# EAGLE design TDS Sensor - no bottom silk (EAGLE 9.6.1)
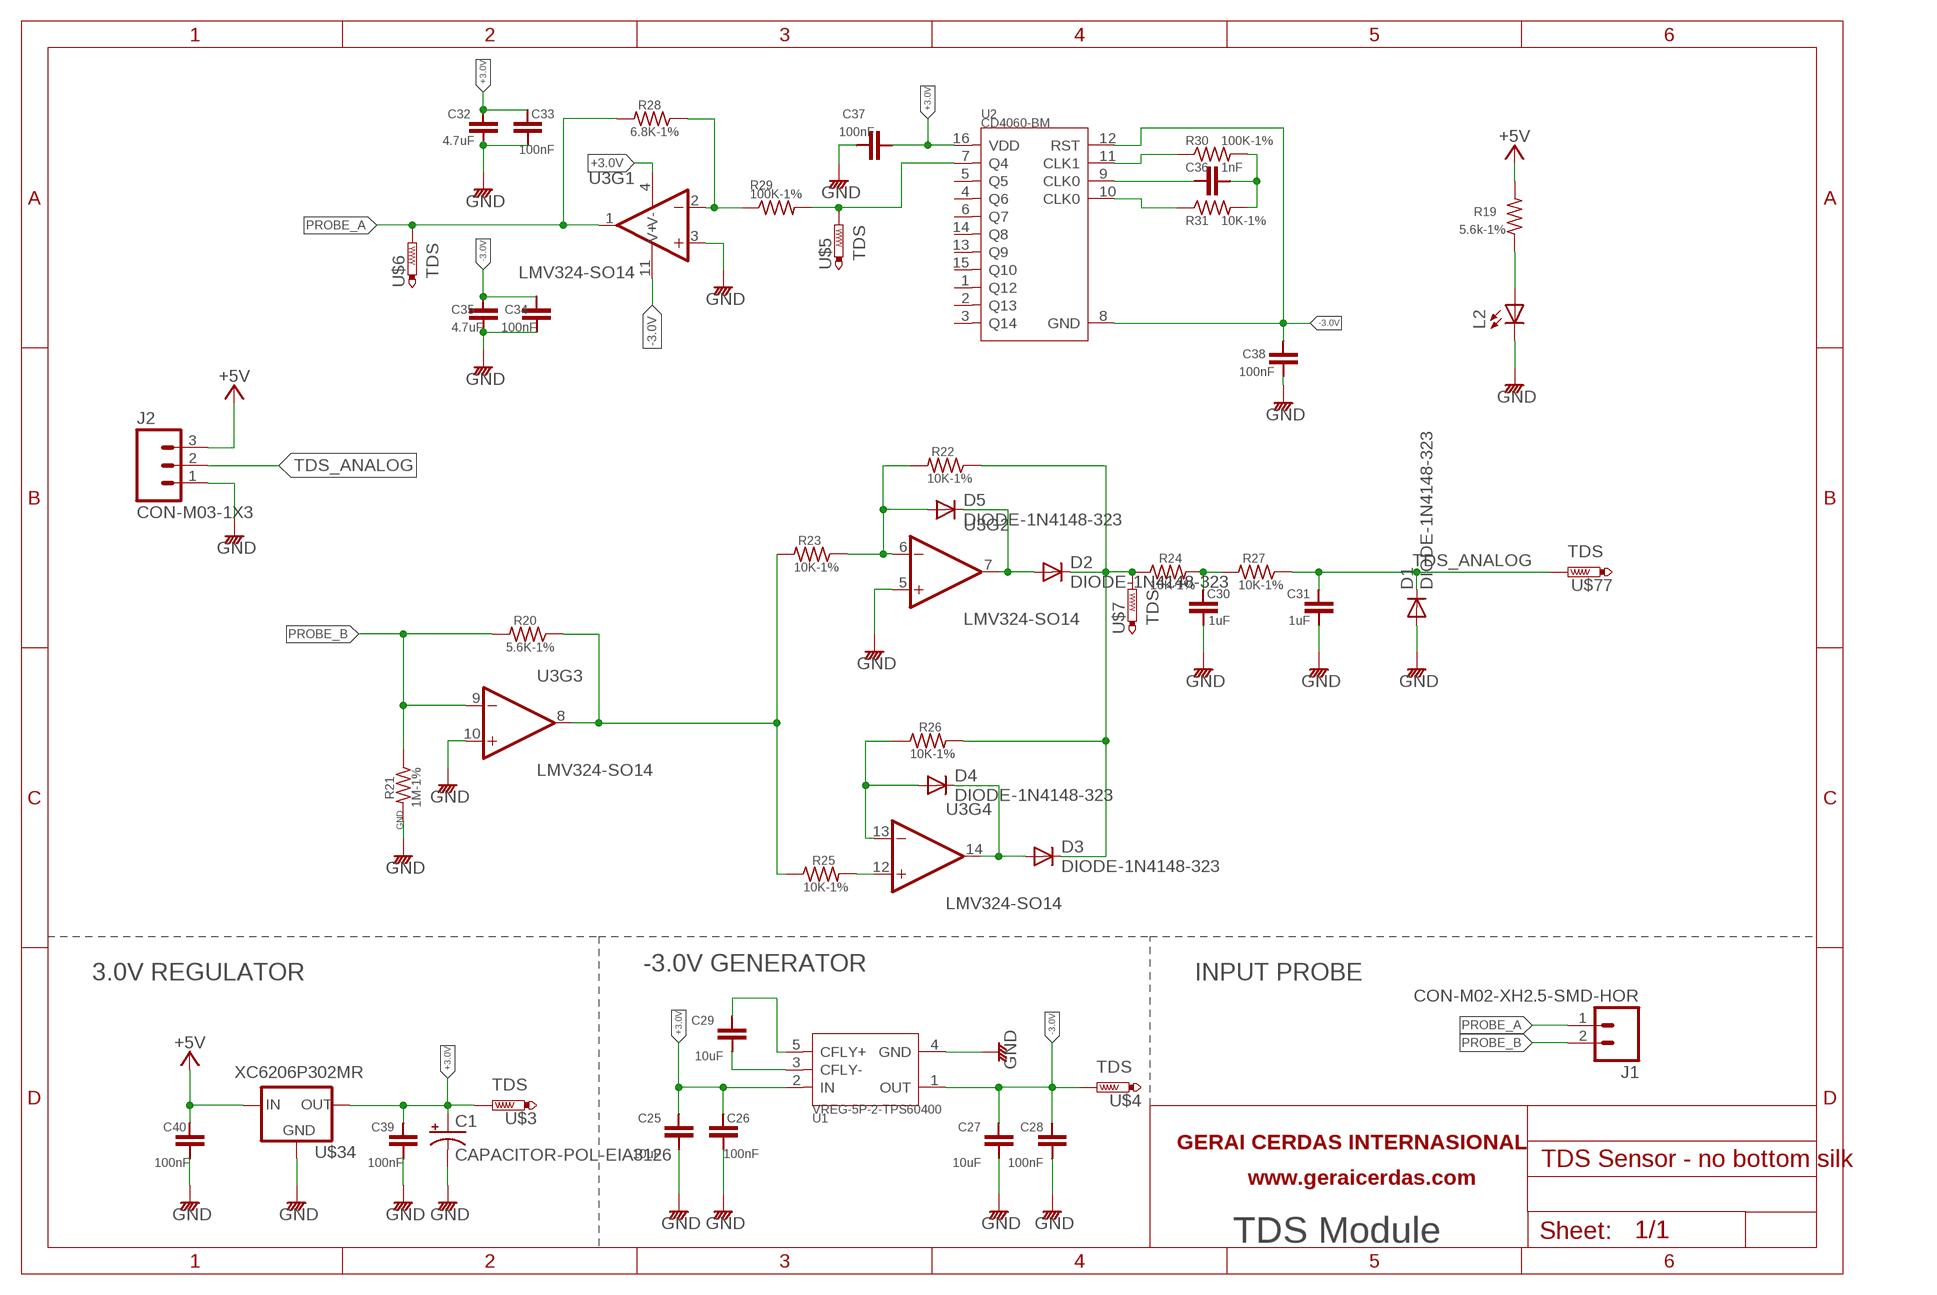
[diagram p0: schematic, sheet 1]

## Parts
C1  CAPACITOR-POL-EIA3126  [EIA3126]
C25  10uF  CAPACITOR-SMD0603  [C0603]
C26  100nF  CAPACITOR-SMD0603  [C0603]
C27  10uF  CAPACITOR-SMD0603  [C0603]
C28  100nF  CAPACITOR-SMD0603  [C0603]
C29  10uF  CAPACITOR-SMD0603  [C0603]
C30  1uF  CAPACITOR-SMD0603  [C0603]
C31  1uF  CAPACITOR-SMD0603  [C0603]
C32  4.7uF  CAPACITOR-SMD0603  [C0603]
C33  100nF  CAPACITOR-SMD0603  [C0603]
C34  100nF  CAPACITOR-SMD0603  [C0603]
C35  4.7uF  CAPACITOR-SMD0603  [C0603]
C36  1nF  CAPACITOR-SMD0603  [C0603]
C37  100nF  CAPACITOR-SMD0603  [C0603]
C38  100nF  CAPACITOR-SMD0603  [C0603]
C39  100nF  CAPACITOR-SMD0603  [C0603]
C40  100nF  CAPACITOR-SMD0603  [C0603]
D1  DIODE-1N4148-323  [SOD-323]
D2  DIODE-1N4148-323  [SOD-323]
D3  DIODE-1N4148-323  [SOD-323]
D4  DIODE-1N4148-323  [SOD-323]
D5  DIODE-1N4148-323  [SOD-323]
J1  CON-M02-XH2.5-SMD-HOR  [JST-XH2.5-2P-SMD-HORZ]
J2  CON-M03-1X3  [CON-M03X1]
L2  LED-SMD0805  [LED0805]
R19  5.6k-1%  RESISTOR-SMD0603  [R0603]
R20  5.6K-1%  RESISTOR-SMD0603  [R0603]
R21  1M-1%  RESISTOR-SMD0603  [R0603]
R22  10K-1%  RESISTOR-SMD0603  [R0603]
R23  10K-1%  RESISTOR-SMD0603  [R0603]
R24  10K-1%  RESISTOR-SMD0603  [R0603]
R25  10K-1%  RESISTOR-SMD0603  [R0603]
R26  10K-1%  RESISTOR-SMD0603  [R0603]
R27  10K-1%  RESISTOR-SMD0603  [R0603]
R28  6.8K-1%  RESISTOR-SMD0603  [R0603]
R29  100K-1%  RESISTOR-SMD0603  [R0603]
R30  100K-1%  RESISTOR-SMD0603  [R0603]
R31  10K-1%  RESISTOR-SMD0603  [R0603]
U1  VREG-5P-2-TPS60400  [SOT-23-5]
U2  CD4060-BM  [SO-16]
U3  LMV324-SO14  [SO-14]
U$3  TDS  TESTPAD-SMD2.54  [TESTPAD_2.54]
U$4  TDS  TESTPAD-SMD2.54  [TESTPAD_2.54]
U$5  TDS  TESTPAD-SMD2.54  [TESTPAD_2.54]
U$6  TDS  TESTPAD-SMD2.54  [TESTPAD_2.54]
U$7  TDS  TESTPAD-SMD2.54  [TESTPAD_2.54]
U$28  FRAME  [A4-HOR]
U$34  XC6206P302MR  V-REG2-SOT23  [SOT-23]
U$77  TDS  TESTPAD-SMD2.54  [TESTPAD_2.54]

## Nets
+3.0V: C1.A(+) C25.2 C26.2 C32.2 C33.2 C37.1 C39.2 U1.2(IN) U2.16(VDD) U3.4(V+) U$3.TP U$34.2(OUT)
+5V: C40.2 J2.3 R19.2 U$34.3(IN)
-3.0V: C27.2 C28.2 C34.2 C35.2 C38.2 U1.1(OUT) U2.8(GND) U2.12(RST) U3.11(V-) U$4.TP
GND: C1.C(-) C25.1 C26.1 C27.1 C28.1 C30.1 C31.1 C32.1 C33.1 C34.1 C35.1 C37.2 C38.1 C39.1 C40.1 D1.A J2.1 L2.C R21.2 U1.4(GND) U3.3(+IN) U3.5(+IN) U3.10(+IN) U$34.1(ADJ)
N$1: R25.2 U3.12(+IN)
N$35: L2.A R19.1
N$37: D5.A R22.2 R23.1 U3.6(-IN)
N$38: D2.A D5.C U3.7(OUT)
N$39: D2.C D3.C R22.1 R24.1 R26.2 U$7.TP
N$41: D4.A R26.1 U3.13(-IN)
N$42: D3.A D4.C U3.14(OUT)
N$43: R20.1 R23.2 R25.1 U3.8(OUT)
N$44: C30.2 R24.2 R27.2
N$46: R28.1 R29.1 U3.2(-IN)
N$48: C29.2 U1.5(CFLY+)
N$49: R30.1 U2.11(CLK1)
N$50: C36.1 U2.9(CLK0)
N$51: R31.1 U2.10(CLK0)
N$52: C36.2 R30.2 R31.2
N$53: R29.2 U2.7(Q4) U$5.TP
N$54: C29.1 U1.3(CFLY-)
PROBE_A: J1.1 R28.2 U3.1(OUT) U$6.TP
PROBE_B: J1.2 R20.2 R21.1 U3.9(-IN)
TDS_ANALOG: C31.2 D1.C J2.2 R27.1 U$77.TP
Unconnected: U2.1(Q12) U2.2(Q13) U2.3(Q14) U2.4(Q6) U2.5(Q5) U2.6(Q7) U2.13(Q9) U2.14(Q8) U2.15(Q10)

## Notes on the sheet
- -3.0V GENERATOR
- 3.0V REGULATOR | INPUT PROBE
- TDS Module

## Library data of the parts
C1 = geraicerdas:CAPACITOR-POL
C25-C40 = geraicerdas:CAPACITOR
D1-D5 = geraicerdas:DIODE: DIODE, SWITCHING, 75V, SOD-523F-2 Source : View Datasheet <https://datasheet.lcsc.com/szlcsc/1810242227_ON-Semiconductor-1N4148WT_C232841.pdf>; DATASHEET: https://datasheet.lcsc.com/szlcsc/1810232207_ON-Semiconductor-1N4148WS_C118873.pdf; MANUFACTURER_PART_NUMBER: 1N4148WS
J1 = geraicerdas:CON-M02
J2 = geraicerdas:CON-M03
L2 = geraicerdas:LED
R19-R31 = geraicerdas:RESISTOR
U1 = geraicerdas:VREG-5P-2
U2 = geraicerdas:CD4060
U3 = geraicerdas:LMV324
U$3-U$7 U$77 = geraicerdas:TESTPAD
U$28 = geraicerdas:FRAME
U$34 = geraicerdas:V-REG2

## Net classes
0 default: width 0.254 mm, clearance 0.254 mm

## Board
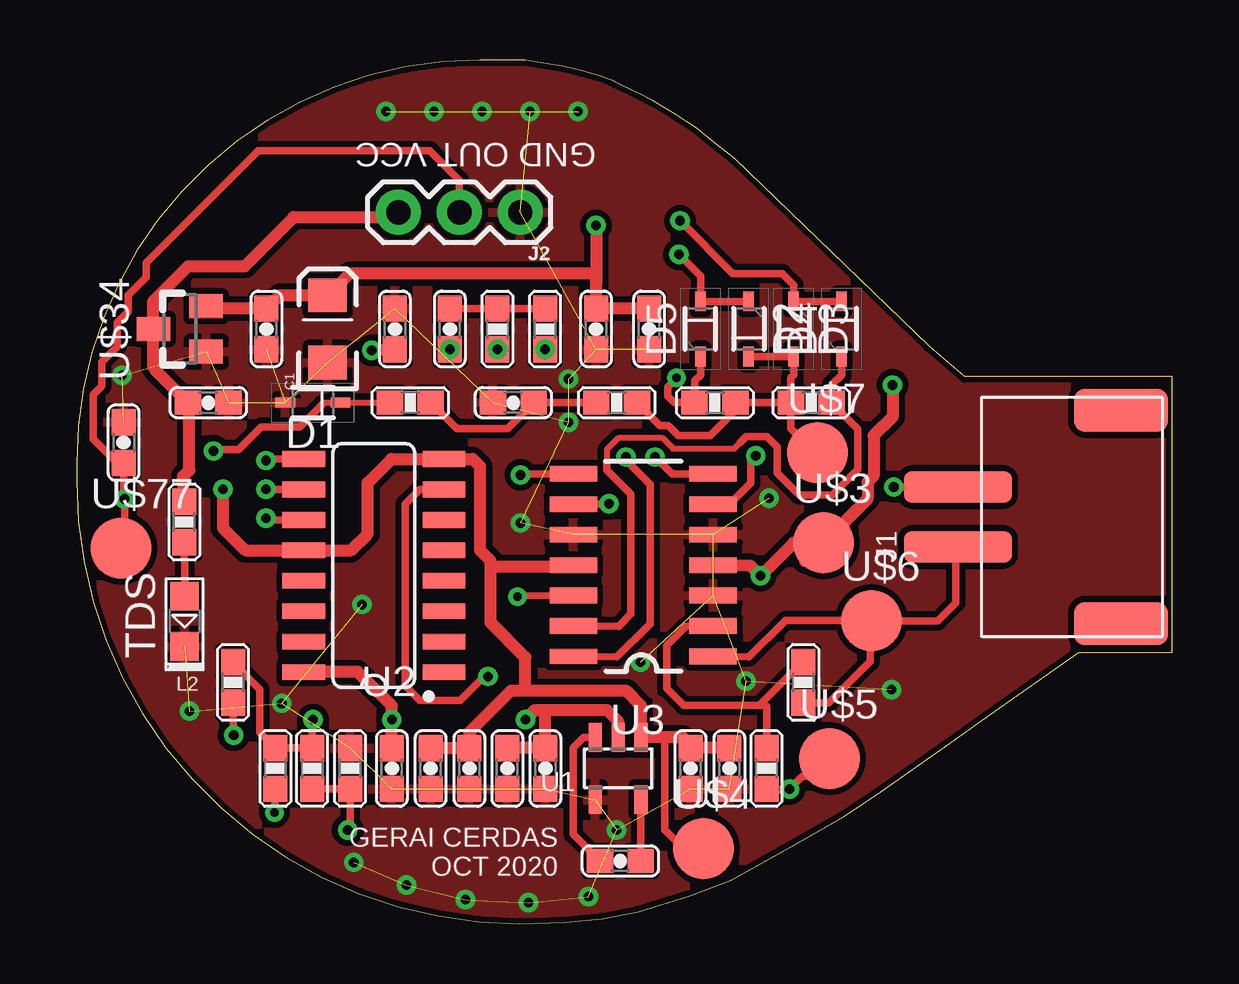
[diagram p1: board, top side]
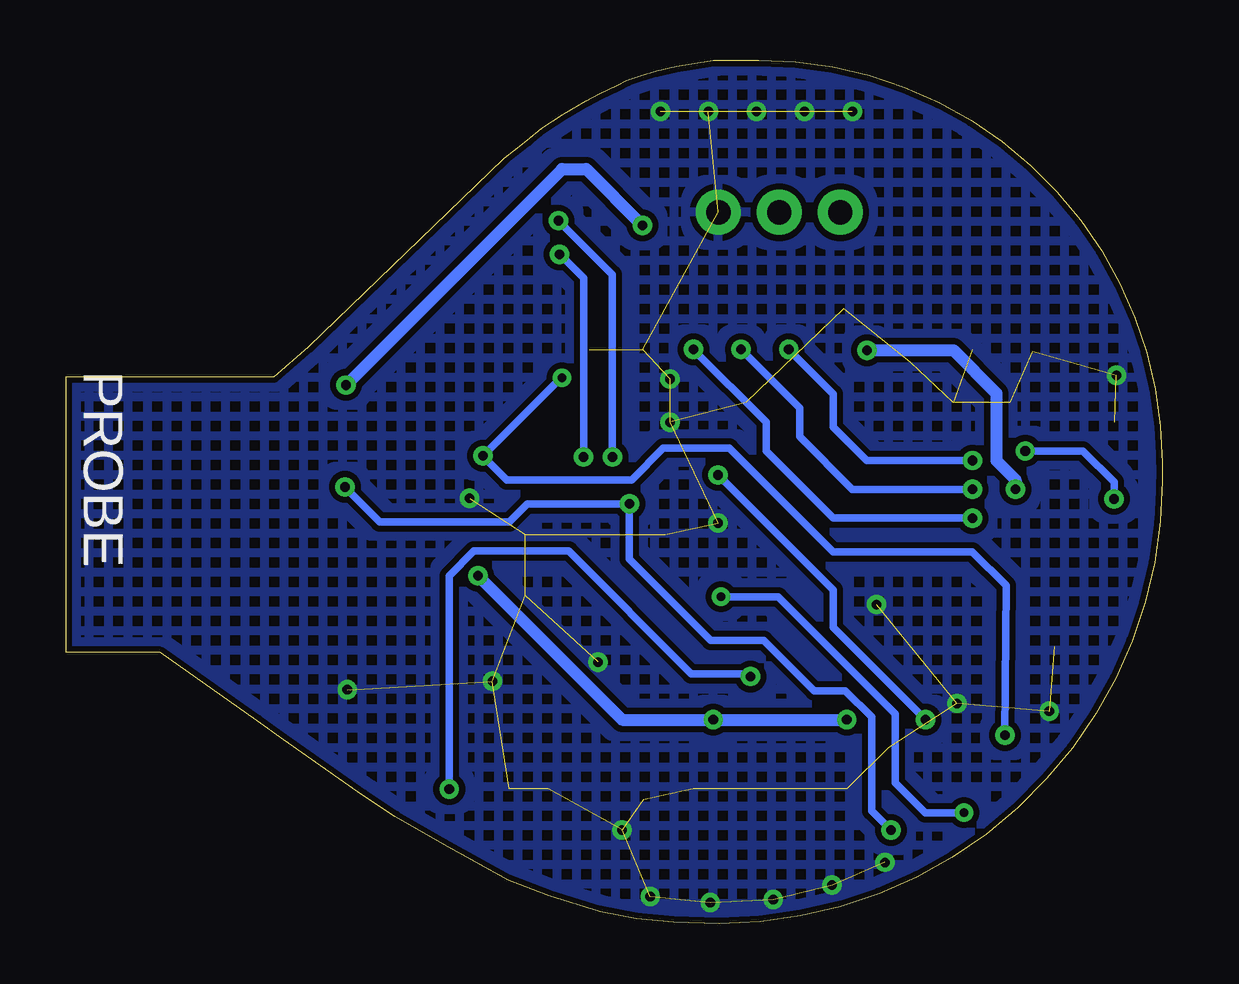
[diagram p2: board, bottom side, seen from below]

Size 45.65 x 36 mm. Coordinates in mm from the lower left corner, seen from the top.
Outline: 0,19.2 0,18.45 arc90 18.45,0 20.35,0.05 21.9,0.2 23.4,0.5 25.55,1.15 27.25,1.8 29.95,3.3 31.95,4.45 33.3,5.35 36.6,7.65 37.7,8.45 41.75,11.3 45.65,11.3 45.65,22.8 37,22.8 35.55,24.05 27.4,31.9 26.85,32.35 26.45,32.65 25.85,33.15 24.95,33.75 24,34.3 23.45,34.6 22.7,34.95 22.3,35.15 21.75,35.35 21.05,35.55 20.25,35.75 19.6,35.85 18.7,36 16.8,36 arc90 0,19.2
Copper layers (1*16): Top 0.035mm / dielectric 1.5mm / Bottom 0.035mm
Design rules "Gerai_Cerdas_DRU_v2_0_4mil *": minimum track width 6mil, minimum drill 0.3mm, track to track 1mil, track to pad 6mil, pad to pad 6mil, via to via 6mil, smd to smd 0mil, copper to edge 10mil, drill to drill 10mil, minimum pad ring 12mil, minimum via ring 8mil, stop-mask expansion 2mil, vias tented up to drill 25mil, thermal gap 10mil

### Footprints (pad centres in the part's own frame; a part is rotated, then mirrored left to right if it is on the bottom)
EIA3126 = smd 1.4 x 1.6: A 1.4,0; C -1.4,0
C0603 = smd 1.1 x 1: 1 -0.85,0; 2 0.85,0
SOD-323 = smd 0.82 x 0.42: A -1.15,0; C 1.15,0
JST-XH2.5-2P-SMD-HORZ = smd 1.3 x 4.5: 1 -1.25,5.08; 2 1.25,5.08 | smd 1.8 x 3.9: 3 -4.45,-1.72; 4 4.45,-1.72
CON-M03X1 = drill 1.016 pad 1.88: 1 -2.54,0; 2 0,0; 3 2.54,0
LED0805 = smd 1.2 x 1.2: A 0,-1.05; C 0,1.05
R0603 = smd 1.1 x 1: 1 -0.85,0; 2 0.85,0
SOT-23-5 = smd 0.55 x 1.2: 1 -0.95,-1.3; 2 0,-1.3; 3 0.95,-1.3; 4 0.95,1.3; 5 -0.95,1.3
SO-16 = smd 0.66 x 1.778: 1 -4.445,-2.921; 2 -3.175,-2.921; 3 -1.905,-2.921; 4 -0.635,-2.921; 5 0.635,-2.921; 6 1.905,-2.921; 7 3.175,-2.921; 8 4.445,-2.921; 9 4.445,2.921; 10 3.175,2.921; 11 1.905,2.921; 12 0.635,2.921; 13 -0.635,2.921; 14 -1.905,2.921; 15 -3.175,2.921; 16 -4.445,2.921
SO-14 = smd 0.66 x 1.98: 1 -3.81,-2.915; 2 -2.54,-2.915; 3 -1.27,-2.915; 4 0,-2.915; 5 1.27,-2.915; 6 2.54,-2.915; 7 3.81,-2.915; 8 3.81,2.915; 9 2.54,2.915; 10 1.27,2.915; 11 0,2.915; 12 -1.27,2.915; 13 -2.54,2.915 | smd 0.62 x 1.98: 14 -3.81,2.915
TESTPAD_2.54 = smd 2.54 x 2.54: TP 0,0
SOT-23 = smd 1 x 1.4: 1 -0.95,-1.1; 2 0.95,-1.1; 3 0,1.1

### Placement (x,y rotation side)
C1  10.46,24.79 90 top
C25  21.65,24.79 90 top
C26  23.86,24.79 90 top
C27  14.75,6.46 90 top
C28  13.26,24.79 270 top
C29  22.66,2.61 0 top
C30  18.2,21.71 0 top
C31  1.97,20.05 270 top
C32  17.95,6.46 90 top
C33  13.14,6.46 90 top
C34  25.59,6.46 90 top
C35  27.2,6.46 90 top
C36  15.56,24.79 90 top
C37  19.53,6.46 270 top
C38  16.37,6.46 90 top
C39  7.91,24.79 90 top
C40  5.49,21.71 180 top
D1  9.85,21.71 0 top
D2  28,24.79 270 top
D3  29.88,24.79 270 top
D4  31.88,24.79 90 top
D5  26,24.79 90 top
J1  41.8,16.95 90 top
J2  15.95,29.65 180 top
L2  4.5,12.6 180 top
R19  4.49,16.74 90 top
R20  9.82,6.46 270 top
R21  11.4,6.46 90 top
R22  26.6,21.71 180 top
R23  6.52,10.05 90 top
R24  22.51,21.71 180 top
R25  8.28,6.46 270 top
R26  30.61,21.71 180 top
R27  13.91,21.71 0 top
R28  30.28,10.05 270 top
R29  28.75,6.46 270 top
R30  19.52,24.79 90 top
R31  17.54,24.79 90 top
U1  22.57,6.46 180 top
U2  12.38,14.93 90 top
U3  23.61,14.94 90 top
U$3  31.12,15.88 0 top
U$4  26.12,3.12 0 top
U$5  31.38,6.88 0 top
U$6  33.12,12.62 0 top
U$7  30.88,19.62 0 top
U$28  -11,-8 0 top  (outside the outline)
U$34  4.3,24.79 90 top
U$77  1.85,15.65 0 top

### Tracks (layer width: path | path; a pad name or v marks a point on that pad's centre or on a via)
+3.0V  (via drill 0.4)
  Top 0.508: C32.2 C37.1 19.53,8.87 19.5,8.9 | C26.2 C25.2 | U$34.2 5.5,25.64 C39.2 8.32,26.05 8.33,26.06 8.46,26.19 C1.A 11.38,27.1 21.65,27.1 21.65,26.6 | 19.5,8.9 19.1,8.9 v18.7,8.5 | 19.5,8.9 22.1,8.9 22.57,8.43 U1.2 | C33.2 v13.14,8.5 13.14,9.06 11.7,10.5 9.48,10.5 U2.16 | 21.65,25.75 C25.2 | C25.2 21.65,26.6 | v21.65,29.1 21.65,26.6 | U3.4 28.07,14.93 v28.5,14.5 29.88,15.88 U$3.TP | v34,22.45 34,21.12 33.21,20.34 33.21,18.66 32.96,18.41 32.96,17.71 U$3.TP | 30.35,15.1 U$3.TP
  Bottom 0.508: v13.14,8.5 v18.7,8.5 22.5,8.5 v28.5,14.5 | v34,22.45 25,31.45 24,31.45 v21.65,29.1
+5V
  Top 0.508: R19.2 4.44,18.64 4.7,18.9 4.7,21.66 C40.2 3.3,23.05 3.3,23.1 3.2,23.2 U$34.3 3.2,25.95 4.65,27.4 7,27.4 9.05,29.45 13.21,29.45 J2.3
-3.0V  (via drill 0.4)
  Top 0.305: 24.5,7.76 24.5,3.9 25.11,3.29
  Top 0.508: C35.2 25.7,7.31 | 25.7,7.31 C34.2 | C27.2 C38.2 16.37,7.97 18.1,9.7 18.7,9.7 | 25.7,7.31 25.25,7.76 24.5,7.76 U1.1 23.52,9.08 22.9,9.7 18.7,9.7 | C28.2 13.22,23.9 v12.3,23.9 | v6.1,18.1 6.1,16.5 7.04,15.56 U2.12 11.44,15.56 12.12,16.25 12.12,18.38 13.12,19.38 U2.8 16.5,19.37 16.81,19.06 16.81,15.56 17.25,15.12 17.25,14.88 | 18.7,9.7 18.7,11.1 17.25,12.55 17.25,14.88 | 17.3,14.93 17.25,14.88 | U3.11 20.58,14.88 17.25,14.88 | 26,3.88 26,3.25 U$4.TP 25.95,3.29 25.11,3.29
  Bottom 0.508: v12.3,23.9 8.7,23.9 6.9,22.1 6.9,19.3 6.1,18.5 v6.1,18.1
GND  (via drill 0.4)  (45 unrouted)
  other vias: 22.5,3.9 18.5,16.7 11.9,13.3 20.5,22.7 20.5,20.9 28.85,17.73 23.5,10.9 27.9,10.1 21.32,1.12 1.9,22.85 4.7,8.85 33.95,9.75 11.55,2.55 16.9,33.85 13.75,1.6 18.82,0.88 16.2,1 18.9,33.85 14.9,33.85 20.9,33.85 12.9,33.85 8.55,9.18
  pour Bottom (hatched): 60,-1.89 -1.79,-1.89 -0.99,40 60,40
  pour Top: 60.95,-3.29 -3.32,-3.29 -3.12,42 60.95,42
N$1  (via drill 0.35)
  Top 0.305: R25.2 8.28,4.66 v8.25,4.62 | v18.38,13.62 18.41,13.65 U3.12
  Bottom 0.305: v8.25,4.62 9.88,4.62 11.12,5.88 11.12,8.75 16,13.62 v18.38,13.62
N$35
  Top 0.305: L2.A 4.5,14.53 R19.1
N$37  (via drill 0.35, 0.4)
  Top 0.305: R23.1 6.52,7.88 v6.55,7.85 | 28.15,19.35 v28.3,19.5 28.1,19.3 28.1,18.38 27.19,17.46 27.18,17.48 U3.6 | D5.A 26,22.88 25.75,22.63 R22.2 24.91,21.71 24.62,22 24.62,22.38 v25,22.75
  Bottom 0.305: v6.55,7.85 6.5,14.1 7.9,15.5 13.7,15.5 18.02,19.82 20.77,19.82 22.1,18.5 27.3,18.5 v28.3,19.5 25.05,22.75 v25,22.75
N$38  (via drill 0.4)
  Top 0.305: v24.1,19.45 24.82,18.73 26.51,18.73 U3.7 | v25.1,27.9 26,27 D5.C D2.A
  Bottom 0.305: v24.1,19.45 24.1,26.9 v25.1,27.9
N$39
  Top 0.305: R26.2 R22.1 27.45,21.39 26.4,20.33 25.08,20.33 24.65,20.77 24.3,20.77 R24.1 | R26.2 29.76,20.63 30.77,19.62 U$7.TP | D2.C D3.C 29.88,22.88 29.76,22.76 R26.2
N$41
  Top 0.254: 22.1,19.25 22.1,19.76 22.57,20.23 24.43,20.23 24.86,19.8 27.4,19.8 27.65,20.05
  Top 0.305: 22.1,19.25 22.1,18.9 23.1,17.9 23.1,12.9 22.59,12.38 U3.13 | 31.46,21.66 R26.1 | R26.1 31.46,22.46 31.88,22.88 D4.A | 27.65,20.05 27.9,20.3 27.95,20.3 27.96,20.31 28.75,20.31 29.2,19.86 29.2,18.78 30.12,17.87 31.49,17.87 32.55,18.93 32.55,20.61 R26.1
N$42  (via drill 0.4)
  Top 0.305: v22.9,19.45 22.9,19.3 23.9,18.3 23.9,12.5 22.52,11.12 U3.14 | v25.15,29.3 27.35,27.1 29.4,27.1 29.88,26.62 D3.A D4.C
  Bottom 0.305: v22.9,19.45 22.9,27.05 v25.15,29.3
N$43  (via drill 0.4)
  Top 0.305: v18.5,18.7 18.54,18.73 20.68,18.73 U3.8 | R23.2 6.52,10.88 7.64,9.76 7.62,9.75 7.62,7.97 R25.1 R20.1 9.82,8.47 v9.85,8.5
  Bottom 0.305: v18.5,18.7 13.7,13.9 13.7,12.35 v9.85,8.5
N$44
  Top 0.305: R24.2 C30.2 17.97,20.64 15.84,20.64 R27.2
N$46
  Top 0.305: R29.1 28.75,9.05 28.7,9.1 28.45,9.1 | 28.45,9.1 25.3,9.1 24.6,9.8 24.6,11.6 25.39,12.38 U3.2 | 28.45,9.1 30.25,10.9 R28.1
N$48
  Top 0.305: C29.2 U1.5
N$49  (via drill 0.4)
  Top 0.305: U2.11 7.97,16.83 v7.9,16.9
  Bottom 0.305: R30.1 16.5,20.91 16.5,19.7 13.7,16.9 v7.9,16.9
  other vias: 19.52,23.94
N$50  (via drill 0.4)
  Top 0.305: U2.9 7.97,19.37 v7.9,19.3
  Bottom 0.305: C36.1 13.7,22.08 13.7,20.7 12.3,19.3 v7.9,19.3
  other vias: 15.56,23.94
N$51  (via drill 0.4)
  Top 0.305: U2.10 v7.9,18.1
  Bottom 0.305: R31.1 15.1,21.5 15.1,20.3 12.9,18.1 v7.9,18.1
  other vias: 17.54,23.94
N$52
  Top 0.305: C36.2 R31.2 R30.2
N$53  (via drill 0.4)
  Top 0.305: R29.2 28.8,5.56 29.96,5.56 v29.7,5.6 30.25,6.14 30.64,6.14 U$5.TP | v17.15,10.3 16.99,10.3 15.99,9.3 14.3,9.3 13.7,9.9 13.7,17.5 14.3,18.1 U2.7
  Bottom 0.305: v29.7,5.6 29.7,14.5 28.68,15.53 24.73,15.53 19.61,10.41 17.26,10.41 v17.15,10.3
N$54
  Top 0.305: C29.1 20.7,3.72 20.7,7.33 21.14,7.76 U1.3
PROBE_A
  Top 0.305: R28.2 31.35,9.2 33.08,10.93 33.08,12.92 33,13 33,12.64 | J1.1 36.5,15.7 36.62,15.57 36.62,13.38 35.88,12.62 U$6.TP 33.1,12.64 33,12.64 | U3.1 28.02,11.12 29.55,12.64 33,12.64
PROBE_B  (via drill 0.4)
  Top 0.305: R20.2 R21.1 11.4,4 v11.3,3.9 | v22.19,17.5 22.16,17.46 22.14,17.48 U3.9 | v34.05,18.2 J1.2
  Bottom 0.305: v11.3,3.9 12.1,4.7 12.1,8.61 13.19,9.7 14.5,9.7 16.6,11.8 18.8,11.8 22.19,15.19 v22.19,17.5 26.45,17.5 27.2,16.75 32.6,16.75 v34.05,18.2
TDS_ANALOG  (via drill 0.4)
  Top 0.254: 10.24,21.64 10.31,21.71 D1.C R27.1
  Top 0.305: v5.7,19.7 5.79,19.76 6.76,19.76 7.7,20.7 9.3,20.7 10.24,21.64 | 2,15.5 U$77.TP | v2,17.7 2,17.5 | 2,17.5 2,15.5 | 2,15.5 2.02,15.47 | 2,17.5 1.97,17.54 C31.2 1.7,19.2 0.7,20.2 0.7,22.05 1.05,22.4 1.05,23.4 1.7,24.05 1.7,25.06 2.15,25.51 2.15,26.2 2.9,26.95 2.9,27.55 7.58,32.23 14.72,32.23 15.95,31 J2.2
  Bottom 0.305: v5.7,19.7 3.3,19.7 2,18.4 v2,17.7

### Text on the board
tPlace: GND OUT VCC | TDS | GERAI CERDAS / OCT 2020
bPlace: PROBE
tDocu: Power Line (3V3 and 5V) : 0.508\mm / Power Line 12V : 1.016mm / Signal : 0.3048mm